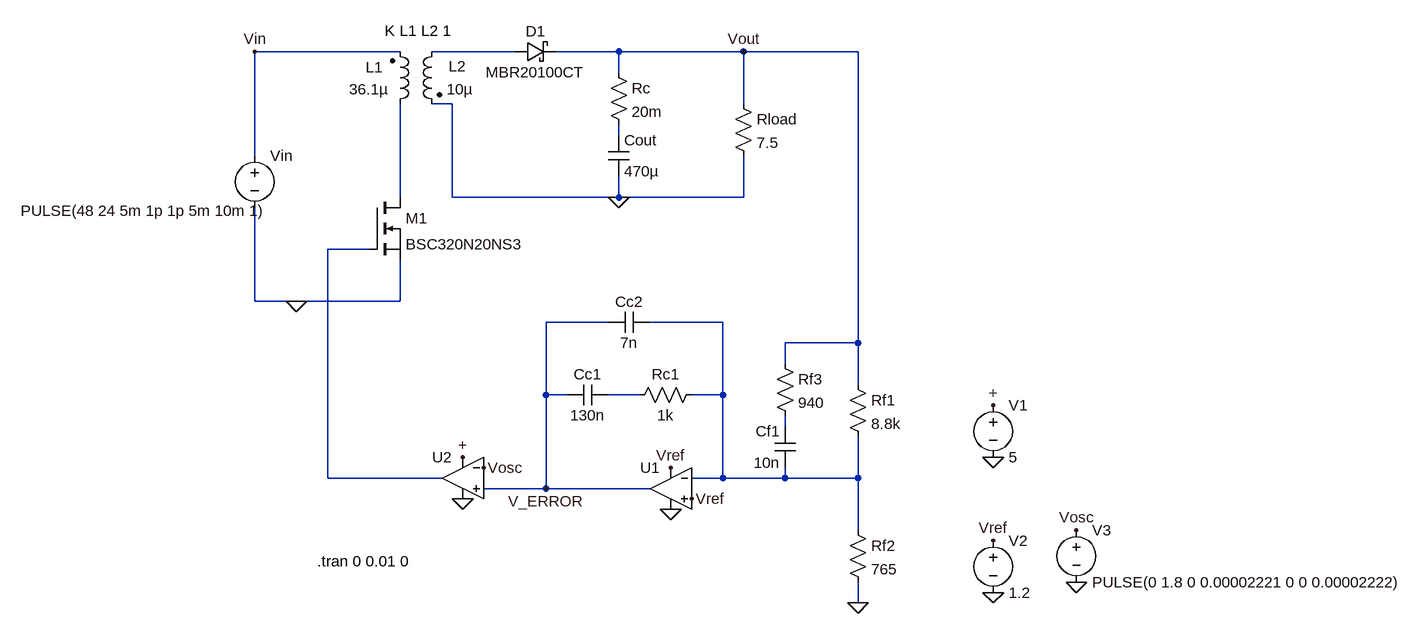
[diagram p0: schematic flyback_input_step_change.asc]
flyback_input_step_change.asc, the LTspice schematic file:
Version 4
SHEET 1 880 680
WIRE -1824 -864 -2048 -864
WIRE -1648 -864 -1776 -864
WIRE -1488 -864 -1584 -864
WIRE -1296 -864 -1488 -864
WIRE -1120 -864 -1296 -864
WIRE -1488 -832 -1488 -864
WIRE -1744 -784 -1776 -784
WIRE -1296 -784 -1296 -864
WIRE -1488 -736 -1488 -752
WIRE -2048 -704 -2048 -864
WIRE -1824 -640 -1824 -784
WIRE -1744 -640 -1744 -784
WIRE -1488 -640 -1488 -672
WIRE -1488 -640 -1744 -640
WIRE -1296 -640 -1296 -704
WIRE -1296 -640 -1488 -640
WIRE -1872 -560 -1936 -560
WIRE -2048 -480 -2048 -624
WIRE -1984 -480 -2048 -480
WIRE -1824 -480 -1824 -544
WIRE -1824 -480 -1984 -480
WIRE -1504 -448 -1600 -448
WIRE -1328 -448 -1440 -448
WIRE -1120 -416 -1120 -864
WIRE -1120 -416 -1232 -416
WIRE -1232 -384 -1232 -416
WIRE -1120 -352 -1120 -416
WIRE -1600 -336 -1600 -448
WIRE -1568 -336 -1600 -336
WIRE -1456 -336 -1504 -336
WIRE -1328 -336 -1328 -448
WIRE -1328 -336 -1376 -336
WIRE -1232 -288 -1232 -304
WIRE -1936 -208 -1936 -560
WIRE -1760 -208 -1936 -208
WIRE -1328 -208 -1328 -336
WIRE -1328 -208 -1376 -208
WIRE -1232 -208 -1232 -224
WIRE -1232 -208 -1328 -208
WIRE -1120 -208 -1120 -272
WIRE -1120 -208 -1232 -208
WIRE -1600 -192 -1600 -336
WIRE -1600 -192 -1696 -192
WIRE -1440 -192 -1600 -192
WIRE -1120 -128 -1120 -208
WIRE -1120 -16 -1120 -48
FLAG -1984 -480 0
FLAG -1488 -640 0
FLAG -2048 -864 Vin
FLAG -1296 -864 Vout
FLAG -1120 -16 0
FLAG -912 -240 0
FLAG -912 -32 0
FLAG -1408 -224 Vref
FLAG -912 -320 +
FLAG -1376 -176 Vref
FLAG -912 -112 Vref
FLAG -1728 -240 +
FLAG -1696 -224 Vosc
FLAG -784 -48 0
FLAG -784 -128 Vosc
FLAG -1408 -160 0
FLAG -1728 -176 0
FLAG -1600 -192 V_ERROR
SYMBOL ind2 -1760 -880 M0
WINDOW 0 -37 38 Left 2
WINDOW 3 -48 74 Left 2
SYMATTR InstName L2
SYMATTR Value 10µ
SYMATTR Type ind
SYMBOL ind2 -1840 -768 M180
WINDOW 0 -37 72 Left 2
WINDOW 3 -63 38 Left 2
SYMATTR InstName L1
SYMATTR Value 36.1µ
SYMATTR Type ind
SYMBOL nmos -1872 -640 R0
SYMATTR InstName M1
SYMATTR Value BSC320N20NS3
SYMBOL voltage -2048 -720 R0
WINDOW 123 0 0 Left 2
WINDOW 39 0 0 Left 2
WINDOW 3 -360 101 Left 2
SYMATTR InstName Vin
SYMATTR Value PULSE(48 24 5m 1p 1p 5m 10m 1)
SYMBOL cap -1504 -736 R0
SYMATTR InstName Cout
SYMATTR Value 470µ
SYMBOL res -1312 -800 R0
SYMATTR InstName Rload
SYMATTR Value 7.5
SYMBOL res -1136 -368 R0
SYMATTR InstName Rf1
SYMATTR Value 8.8k
SYMBOL res -1136 -144 R0
SYMATTR InstName Rf2
SYMATTR Value 765
SYMBOL res -1248 -400 R0
SYMATTR InstName Rf3
SYMATTR Value 940
SYMBOL cap -1216 -224 R180
WINDOW 0 24 56 Left 2
WINDOW 3 24 8 Left 2
SYMATTR InstName Cf1
SYMATTR Value 10n
SYMBOL Opamps\\UniversalOpamp2 -1408 -192 M0
SYMATTR InstName U1
SYMBOL voltage -912 -336 R0
WINDOW 123 0 0 Left 2
WINDOW 39 0 0 Left 2
SYMATTR InstName V1
SYMATTR Value 5
SYMBOL voltage -912 -128 R0
WINDOW 123 0 0 Left 2
WINDOW 39 0 0 Left 2
SYMATTR InstName V2
SYMATTR Value 1.2
SYMBOL res -1360 -352 R90
WINDOW 0 0 56 VBottom 2
WINDOW 3 32 56 VTop 2
SYMATTR InstName Rc1
SYMATTR Value 1k
SYMBOL cap -1568 -320 R270
WINDOW 0 32 32 VTop 2
WINDOW 3 0 32 VBottom 2
SYMATTR InstName Cc1
SYMATTR Value 130n
SYMBOL cap -1504 -432 R270
WINDOW 0 32 32 VTop 2
WINDOW 3 0 32 VBottom 2
SYMATTR InstName Cc2
SYMATTR Value 7n
SYMBOL voltage -784 -144 R0
WINDOW 123 0 0 Left 2
WINDOW 39 0 0 Left 2
SYMATTR InstName V3
SYMATTR Value PULSE(0 1.8 0 0.00002221 0 0 0.00002222)
SYMBOL Opamps\\UniversalOpamp2 -1728 -208 M0
SYMATTR InstName U2
SYMBOL res -1504 -848 R0
SYMATTR InstName Rc
SYMATTR Value 20m
SYMBOL schottky -1648 -848 R270
WINDOW 0 32 32 VTop 2
WINDOW 3 0 32 VBottom 2
SYMATTR InstName D1
SYMATTR Value MBR20100CT
SYMATTR Description Diode
SYMATTR Type diode
TEXT -1848 -896 Left 2 !K L1 L2 1
TEXT -1952 -80 Left 2 !.tran 0 0.01 0

The netlist it stands for:
* flyback_input_step_change.asc
L2 N001 0 10µ
L1 N003 Vin 36.1µ
M1 N003 N004 0 0 BSC320N20NS3
Vin Vin 0 PULSE(48 24 5m 1p 1p 5m 10m 1)
Cout N002 0 470µ
Rload Vout 0 7.5
Rf1 Vout N005 8.8k
Rf2 N005 0 765
Rf3 Vout N007 940
Cf1 N005 N007 10n
XU1 Vref N005 Vref 0 V_ERROR level.2 Avol=1Meg GBW=10Meg Slew=10Meg ilimit=25m rail=0 Vos=0 phimargin=45 en=0 enk=0 in=0 ink=0 Rin=500Meg  ; pins IN+ IN- V+ V- OUT
V1 + 0 5
V2 Vref 0 1.2
Rc1 N005 N006 1k
Cc1 V_ERROR N006 130n
Cc2 V_ERROR N005 7n
V3 Vosc 0 PULSE(0 1.8 0 0.00002221 0 0 0.00002222)
XU2 V_ERROR Vosc + 0 N004 level.2 Avol=1Meg GBW=10Meg Slew=10Meg ilimit=25m rail=0 Vos=0 phimargin=45 en=0 enk=0 in=0 ink=0 Rin=500Meg  ; pins IN+ IN- V+ V- OUT
Rc Vout N002 20m
D1 N001 Vout MBR20100CT
.model D D
.lib standard.dio
.model NMOS NMOS
.model PMOS PMOS
.lib standard.mos
K L1 L2 1
.tran 0 0.01 0
.lib UniversalOpamps2.sub
.backanno
.end